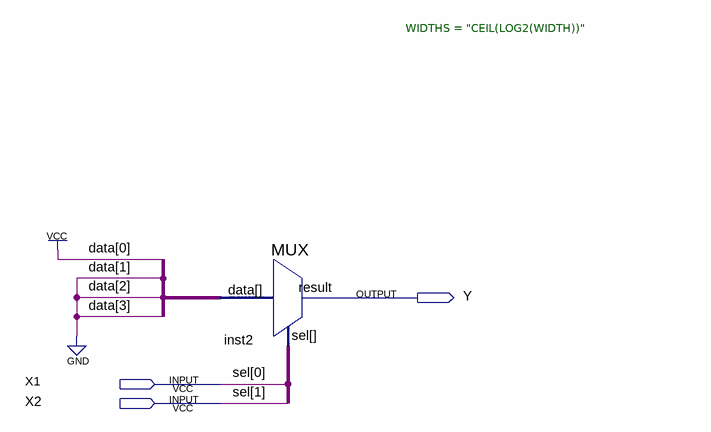
[diagram p0: schematic sheet]
// Quartus schematic ili-ne.bdf as structural Verilog: 1 symbols, 3 pins
module \ili-ne  (
  input  X1,
  input  X2,
  output Y
);

  wire undriven, undriven_2;

  MUX #(.WIDTHS("CEIL(LOG2(WIDTH))")) inst2 (.data(undriven_2), .sel(undriven), .result(Y));

  // Other names for the same wires on the sheet: sel[1:0] = {X2, X1}
endmodule
